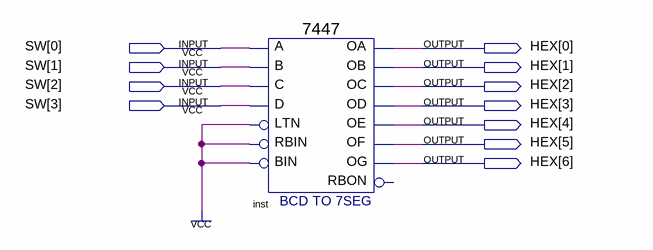
[diagram p0: schematic sheet]
// Quartus schematic bcdto7seg.bdf as structural Verilog: 1 symbols, 11 pins
module bcdto7seg (
  input  [3:0] SW,
  output [6:0] HEX
);

  \7447  inst (
    .LTN(1'b1), .B(SW[1]), .C(SW[2]), .D(SW[3]), .RBIN(1'b1), .BIN(1'b1), .A(SW[0]), .OB(HEX[1]),
    .OC(HEX[2]), .OE(HEX[4]), .OD(HEX[3]), .OF(HEX[5]), .OG(HEX[6]), .OA(HEX[0]));  // open: RBON
endmodule
